# Altium schematic sheet Sheet2.SchDoc
size A; SheetNumber: 1; SheetTotal: 2
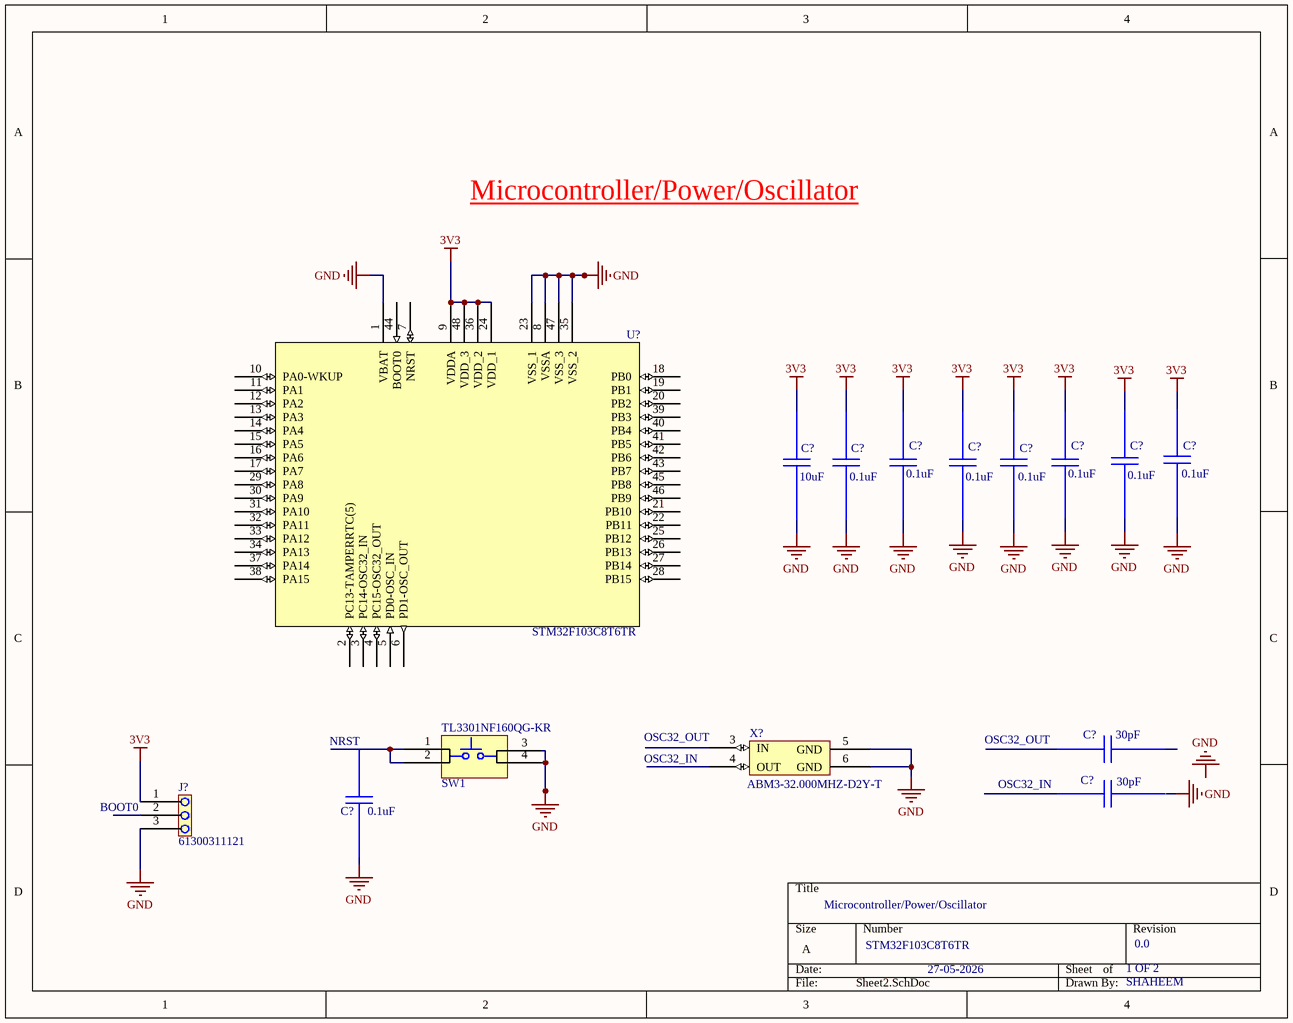
[diagram p0: Sheet2.SchDoc]

## Parts
(Parts that share a designator on the sheet are numbered #1, #2 ... from top to bottom, then left to right.)
C?#1  10uF
C?#2  0.1uF
C?#3  0.1uF
C?#4  0.1uF
C?#5  0.1uF
C?#6  0.1uF
C?#7  0.1uF
C?#8  0.1uF
C?#9  0.1uF
C?#10  30pF
C?#11  30pF
J?  61300311121
TL3301NF160QG-KR  SW1
U?  STM32F103C8T6TR
X?  ABM3-32.000MHZ-D2Y-T

## Nets
3V3: U?.9(VDDA) U?.24(VDD_1) U?.36(VDD_2) U?.48(VDD_3)
GND: U?.1(VBAT) U?.8(VSSA) U?.23(VSS_1) U?.35(VSS_2) U?.47(VSS_3) X?.5(GND) X?.6(GND)
NetTL3301NF160QG-KR_1: TL3301NF160QG-KR.1 TL3301NF160QG-KR.2

Not connected (* = marked no-connect by the designer): J? 1 2 3; TL3301NF160QG-KR 3 4; U? 2(PC13-TAMPERRTC(5)) 3(PC14-OSC32_IN) 4(PC15-OSC32_OUT) 5(PD0-OSC_IN) 6(PD1-OSC_OUT) 7(NRST) 10(PA0-WKUP) 11(PA1) 12(PA2) 13(PA3) 14(PA4) 15(PA5) 16(PA6) 17(PA7) 18(PB0) 19(PB1) 20(PB2) 21(PB10) 22(PB11) 25(PB12) 26(PB13) 27(PB14) 28(PB15) 29(PA8) 30(PA9) 31(PA10) 32(PA11) 33(PA12) 34(PA13) 37(PA14) 38(PA15) 39(PB3) 40(PB4) 41(PB5) 42(PB6) 43(PB7) 44(BOOT0) 45(PB8) 46(PB9); X? 3(IN) 4(OUT)

## Notes on the sheet
- Microcontroller/Power/Oscillator
- (near C?#9) NRST
- (near X?) OSC32_OUT
- OSC32_IN
- (near C?#10) OSC32_OUT
- (near J?) BOOT0
- (near C?#10) OSC32_IN
- STM32F103C8T6TR
- 27-05-2026
- 1 OF 2
- 0.0
- SHAHEEM
- Labels drawn without touching a wire or pin: GND

## Library data of the parts
C?#1-C?#11 = C0402C104K7PACTU: Multilayer Ceramic Capacitors MLCC - SMD/SMT V 0.1uF X5R 0402 10%; Manufacturer: Yageo Group; Value: 100nF; Voltage Rating (DC): 4V; Supplier: DigiKey; Supplier Part Number: 399-14871-2-ND; Manufacturer Part Number: C0402C104K7PACTU; RoHS: Compliant; Category: Ceramic Capacitors; Stock: 10000; Pricing: 10000=0.01597, 20000=0.01478, 30000=0.01419, 50000=0.01353, 70000=0.01314, 100000=0.01277 (USD); Case/Package: 0402; China RoHS: Compliant; Dielectric: X5R; Dielectric Material: Ceramic; Height: 500µm; Lead Free: Lead Free; Length: 1mm; Lifecycle Status: Production; Max Operating Temperature: 85°C; Min Operating Temperature: -55°C; Mounting Technology: Surface Mount; Number of Terminals: 2; REACH SVHC: Yes; Width: 500µm; ComponentLink1URL: https://datasheet.octopart.com:443/C0402C104K7PACTU-KEMET-datasheet-178499189.pdf?src-supplier=IHS; ComponentLink1Description: https://datasheet.octopart.com:443/C0402C104K7PACTU-KEMET-datasheet-178499189.pdf?src-supplier=IHS; ComponentLink2URL: https://datasheet.octopart.com:443/C0402C104K7PACTU-KEMET-datasheet-137357760.pdf?src-supplier=Ciiva; ComponentLink2Description: https://datasheet.octopart.com:443/C0402C104K7PACTU-KEMET-datasheet-137357760.pdf?src-supplier=Ciiva; ComponentLink3URL: https://datasheet.octopart.com/C0402C104K7PACTU-KEMET-datasheet-84169754.pdf; ComponentLink3Description: https://datasheet.octopart.com/C0402C104K7PACTU-KEMET-datasheet-84169754.pdf
J? = 61300311121: WR-PHD Straight Male, PCB Header, Through Hole, 1 Rows, 3 Contacts, 2.54mm Pitch; Manufacturer: Wurth Elektronik; Manufacturer Lifecycle Status: ACTIVE; Connector Type: Male Pin; Contact Resistance: 20mΩ; Current Rating: 3A; Insulation Resistance: 1GΩ; Number of Contacts: 3; Operating Supply Voltage: 250V; YEOL: 1 = Estimated lifetime > 10 years; Supplier: DigiKey; Supplier Part Number: 732-5316-ND; Manufacturer Part Number: 61300311121; RoHS: Compliant; Category: Headers and Wire Housings; Stock: 184690; Pricing: 1=0.13, 10=0.113, 25=0.094, 50=0.0798 (USD); Color: Black; Contact Material: Gold; Contact Mating Length: 5.9944mm; Contact Plating: Gold; Gender: Male; Height: 8.94mm; Lead Free: Lead Free; Lead Pitch: 2.54mm; Length: 7.62mm; Lifecycle Status: Production; Max Operating Temperature: 105°C; Min Operating Temperature: -40°C; Mounting Technology: Through Hole; Pins: 3; Number of Positions: 3; Number of Rows: 1; Orientation: Vertical; Packaging: Bulk; Pitch: 2.54mm; Termination: Solder; Voltage Rating: 250V; ComponentLink1URL: https://datasheet.octopart.com:443/61300311121-Wurth-Elektronik-datasheet-168684096.pdf?src-supplier=Wurth+Elektronik; ComponentLink1Description: https://datasheet.octopart.com:443/61300311121-Wurth-Elektronik-datasheet-168684096.pdf?src-supplier=Wurth+Elektronik; ComponentLink2URL: https://datasheet.octopart.com:443/61300311121-W%C3%BCrth-Elektronik-datasheet-44382959.pdf?src-supplier=Future+Electronics; ComponentLink2Description: https://datasheet.octopart.com:443/61300311121-W%C3%BCrth-Elektronik-datasheet-44382959.pdf?src-supplier=Future+Electronics; ComponentLink3URL: https://datasheet.octopart.com:443/61300311121-W%C3%BCrth-Elektronik-datasheet-149524047.pdf?src-supplier=Farnell; ComponentLink3Description: https://datasheet.octopart.com:443/61300311121-W%C3%BCrth-Elektronik-datasheet-149524047.pdf?src-supplier=Farnell; ComponentLink4URL: https://datasheet.octopart.com:443/61300311121-W%C3%BCrth-Elektronik-datasheet-21154836.pdf?src-supplier=element14+APAC; ComponentLink4Description: https://datasheet.octopart.com:443/61300311121-W%C3%BCrth-Elektronik-datasheet-21154836.pdf?src-supplier=element14+APAC; ComponentLink5URL: https://datasheet.octopart.com/613-003-111-21-W%C3%BCrth-Elektronik-datasheet-134615323.pdf; ComponentLink5Description: https://datasheet.octopart.com/613-003-111-21-W%C3%BCrth-Elektronik-datasheet-134615323.pdf
TL3301NF160QG-KR = TL3301NF160QG-KR: TL3301 Series SPST 1.6 N Round Button Gull Wing Surface Mount Tactile Switch; Manufacturer: E-Switch; Supplier: DigiKey; Supplier Part Number: 141-TL3301NF160QG-KRCT-ND; Manufacturer Part Number: TL3301NF160QG-KR; RoHS: Compliant; Category: Tactile Switches; Stock: 155244; Pricing: 1=0.25, 10=0.218, 25=0.2044, 100=0.1832, 250=0.16988, 500=0.16032 (USD); Export Control Classification Number (ECCN) Code: EAR99; Harmonized Tariff Schedule (HTS) Code: 8536.50.70.00; Introduction Date: 2022-07-21; Lifecycle Status: Production; REACH SVHC: Yes; ComponentLink1URL: https://datasheet.octopart.com:443/TL3301NF160QG-KR-E-Switch-datasheet-182203455.pdf?src-supplier=IHS; ComponentLink1Description: https://datasheet.octopart.com:443/TL3301NF160QG-KR-E-Switch-datasheet-182203455.pdf?src-supplier=IHS; ComponentLink2URL: https://datasheet.octopart.com:443/TL3301NF160QG-KR-E-Switch-datasheet-186526752.pdf?src-supplier=Future+Electronics; ComponentLink2Description: https://datasheet.octopart.com:443/TL3301NF160QG-KR-E-Switch-datasheet-186526752.pdf?src-supplier=Future+Electronics; ComponentLink3URL: https://datasheet.octopart.com:443/TL3301NF160QG-KR-E-Switch-datasheet-26831017.pdf?src-supplier=Future+Electronics; ComponentLink3Description: https://datasheet.octopart.com:443/TL3301NF160QG-KR-E-Switch-datasheet-26831017.pdf?src-supplier=Future+Electronics
U? = STM32F103C8T6TR: MCU 32-bit STM32F1 ARM Cortex M3 RISC 64KB Flash 2.5V/3.3V 48-Pin LQFP T/R; Manufacturer: STMicroelectronics; ADC Channels (Resolution): 10-Ch 12-Bit; Data Bus Width: 32b; EEPROM Memory Size: 0B; Frequency: 72MHz; Interface: CAN, IrDA, LIN, USB; Clock Frequency: 1.25MHz; Max Power Dissipation: 363mW; Max Supply Current: 50mA; Max Supply Voltage: 3.6V; Min Supply Voltage: 2V; Nominal Supply Current: 1.7µA; Number of A/D Converters: 2; Number of ADC Channels: 10; Number of I/Os: 37; Number of Timers/Counters: 4; Number of USART Channels: 3; Operating Supply Voltage: 3.3V; Oscillator Type: Internal; Peripherals: POR; RAM Size: 20kB; Watchdog Timer: Yes; Supplier: DigiKey; Supplier Part Number: 497-17666-1-ND; Manufacturer Part Number: STM32F103C8T6TR; RoHS: Compliant; Category: Microcontrollers; Stock: 4099; Pricing: 1=6.15, 10=4.713, 25=4.3536, 100=3.9587, 250=3.77388 (USD); Case/Package: LFQFP; China RoHS: Compliant; Contact Plating: Gold; Core Architecture: ARM; Flash Memory Size: 64kB; Height - Seated (Max): 1.6mm; Lead Free: Lead Free; Length: 7mm; Lifecycle Status: Production; Max Operating Temperature: 85°C; Memory Size: 64kB; Memory Format: FLASH; Min Operating Temperature: -40°C; Number of Channels: 10; Number of I2C Channels: 2; Pins: 48; Number of Programmable I/O: 37; Number of SPI Channels: 2; Number of Terminals: 48; Packaging: Tape and Reel; Radiation Hardening: No; REACH SVHC: Yes; Schedule B: 8542310000, 8542310000|8542310000|8542310000|8542310000|8542310000; Temperature Grade: Industrial; Terminal Pitch: 500µm; Width: 7mm; ComponentLink1URL: https://datasheet.octopart.com:443/STM32F103C8T6TR-STMicroelectronics-datasheet-177520228.pdf?src-supplier=IHS; ComponentLink1Description: https://datasheet.octopart.com:443/STM32F103C8T6TR-STMicroelectronics-datasheet-177520228.pdf?src-supplier=IHS; ComponentLink2URL: https://datasheet.octopart.com:443/STM32F103C8T6TR-STMicroelectronics-datasheet-48026265.pdf?src-supplier=STMicroelectronics+SCT; ComponentLink2Description: https://datasheet.octopart.com:443/STM32F103C8T6TR-STMicroelectronics-datasheet-48026265.pdf?src-supplier=STMicroelectronics+SCT; ComponentLink3URL: https://datasheet.octopart.com:443/STM32F103C8T6TR-STMicroelectronics-datasheet-14363502.pdf?src-supplier=Upverter; ComponentLink3Description: https://datasheet.octopart.com:443/STM32F103C8T6TR-STMicroelectronics-datasheet-14363502.pdf?src-supplier=Upverter; ComponentLink4URL: https://datasheet.octopart.com:443/STM32F103C8T6TR-STMicroelectronics-datasheet-10330614.pdf?src-supplier=STMicroelectronics; ComponentLink4Description: https://datasheet.octopart.com:443/STM32F103C8T6TR-STMicroelectronics-datasheet-10330614.pdf?src-supplier=STMicroelectronics; ComponentLink5URL: https://datasheet.octopart.com:443/STM32F103C8T6TR-STMicroelectronics-datasheet-500013.pdf?src-supplier=STMicroelectronics; ComponentLink5Description: https://datasheet.octopart.com:443/STM32F103C8T6TR-STMicroelectronics-datasheet-500013.pdf?src-supplier=STMicroelectronics; ComponentLink6URL: https://datasheet.octopart.com:443/STM32F103C8T6TR-STMicroelectronics-datasheet-14106724.pdf?src-supplier=iiiC; ComponentLink6Description: https://datasheet.octopart.com:443/STM32F103C8T6TR-STMicroelectronics-datasheet-14106724.pdf?src-supplier=iiiC; ComponentLink7URL: https://datasheet.octopart.com:443/STM32F103C8T6TR-STMicroelectronics-datasheet-17594274.pdf?src-supplier=TME; ComponentLink7Description: https://datasheet.octopart.com:443/STM32F103C8T6TR-STMicroelectronics-datasheet-17594274.pdf?src-supplier=TME; ComponentLink8URL: https://datasheet.octopart.com:443/STM32F103C8T6TR-STMicroelectronics-datasheet-6396519.pdf?src-supplier=SHENGYU+ELECTRONICS; ComponentLink8Description: https://datasheet.octopart.com:443/STM32F103C8T6TR-STMicroelectronics-datasheet-6396519.pdf?src-supplier=SHENGYU+ELECTRONICS
X? = ABM3: Crystal 32MHz ±20ppm (Tol) ±30ppm (Stability) 18pF FUND 25Ohm 2-Pin Mini-CSMD T/R; Manufacturer: Abracon; ESR (Equivalent Series Resistance): 25Ω; Frequency Tolerance: 0.002%; Supplier: DigiKey; Supplier Part Number: 535-10648-2-ND; Manufacturer Part Number: ABM3-32.000MHZ-D2Y-T; RoHS: Compliant; Category: Crystals; Stock: 24871; Pricing: 1000=0.36759, 2000=0.35239, 3000=0.34379, 5000=0.33326, 7000=0.3265, 10000=0.31949 (USD); Case/Package: CSMD; China RoHS: Non-Compliant; Composition: Ceramic; Country of Origin: South Korea; Depth: 3.2mm; Frequency: 32MHz; Frequency Stability: 30ppm; Height: 1.3mm; Harmonized Tariff Schedule (HTS) Code: 8541.60.00.60; Introduction Date: 2013-09-25; Lead Free: Lead Free; Length: 5mm; Lifecycle Status: Production; Load Capacitance: 18pF; Max Operating Temperature: 85°C; Min Operating Temperature: -40°C; Mounting Technology: Surface Mount; Pins: 2; REACH SVHC: Yes; Schedule B: 8541600060; ESR: 25Ω; Termination: SMD/SMT; Tolerance: 0.002%; Width: 3.2mm; ComponentLink1URL: https://datasheet.octopart.com:443/ABM3-32.000MHZ-D2Y-T-Abracon-datasheet-182205007.pdf?src-supplier=JRH+Electronics; ComponentLink1Description: https://datasheet.octopart.com:443/ABM3-32.000MHZ-D2Y-T-Abracon-datasheet-182205007.pdf?src-supplier=JRH+Electronics; ComponentLink2URL: https://datasheet.octopart.com:443/ABM3-32.000MHZ-D2Y-T-Abracon-datasheet-32780515.pdf?src-supplier=IHS; ComponentLink2Description: https://datasheet.octopart.com:443/ABM3-32.000MHZ-D2Y-T-Abracon-datasheet-32780515.pdf?src-supplier=IHS; ComponentLink3URL: https://datasheet.octopart.com:443/ABM3-32.000MHZ-D2Y-T-Abracon-datasheet-13417521.pdf?src-supplier=Sager+Electronics; ComponentLink3Description: https://datasheet.octopart.com:443/ABM3-32.000MHZ-D2Y-T-Abracon-datasheet-13417521.pdf?src-supplier=Sager+Electronics; ComponentLink4URL: https://datasheet.octopart.com:443/ABM3-32.000MHZ-D2Y-T-Abracon-datasheet-8862594.pdf?src-supplier=Sager+Electronics; ComponentLink4Description: https://datasheet.octopart.com:443/ABM3-32.000MHZ-D2Y-T-Abracon-datasheet-8862594.pdf?src-supplier=Sager+Electronics; ComponentLink5URL: https://datasheet.octopart.com:443/ABM3-32.000MHZ-D2Y-T-Abracon-datasheet-8853172.pdf?src-supplier=Sager+Electronics; ComponentLink5Description: https://datasheet.octopart.com:443/ABM3-32.000MHZ-D2Y-T-Abracon-datasheet-8853172.pdf?src-supplier=Sager+Electronics; ComponentLink6URL: https://datasheet.octopart.com:443/ABM3-32.000MHZ-D2Y-T-Abracon-datasheet-8835795.pdf?src-supplier=Sager+Electronics; ComponentLink6Description: https://datasheet.octopart.com:443/ABM3-32.000MHZ-D2Y-T-Abracon-datasheet-8835795.pdf?src-supplier=Sager+Electronics; ComponentLink7URL: https://datasheet.octopart.com:443/ABM3-32.000MHZ-D2Y-T-Abracon-datasheet-8815637.pdf?src-supplier=Sager+Electronics; ComponentLink7Description: https://datasheet.octopart.com:443/ABM3-32.000MHZ-D2Y-T-Abracon-datasheet-8815637.pdf?src-supplier=Sager+Electronics; ComponentLink8URL: https://datasheet.octopart.com:443/ABM3-32.000MHZ-D2Y-T-Abracon-datasheet-8808528.pdf?src-supplier=Sager+Electronics; ComponentLink8Description: https://datasheet.octopart.com:443/ABM3-32.000MHZ-D2Y-T-Abracon-datasheet-8808528.pdf?src-supplier=Sager+Electronics; ComponentLink9URL: https://datasheet.octopart.com:443/ABM3-32.000MHZ-D2Y-T-Abracon-datasheet-8488864.pdf?src-supplier=Sager+Electronics; ComponentLink9Description: https://datasheet.octopart.com:443/ABM3-32.000MHZ-D2Y-T-Abracon-datasheet-8488864.pdf?src-supplier=Sager+Electronics; ComponentLink10URL: https://datasheet.octopart.com:443/ABM3-32.000MHZ-D2Y-T-Abracon-datasheet-8324950.pdf?src-supplier=Sager+Electronics; ComponentLink10Description: https://datasheet.octopart.com:443/ABM3-32.000MHZ-D2Y-T-Abracon-datasheet-8324950.pdf?src-supplier=Sager+Electronics; ComponentLink11URL: https://datasheet.octopart.com:443/ABM3-32.000MHZ-D2Y-T-Abracon-datasheet-577709.pdf?src-supplier=Sager+Electronics; ComponentLink11Description: https://datasheet.octopart.com:443/ABM3-32.000MHZ-D2Y-T-Abracon-datasheet-577709.pdf?src-supplier=Sager+Electronics; ComponentLink12URL: https://datasheet.octopart.com:443/ABM3-32.000MHZ-D2Y-T-Abracon-datasheet-154724144.pdf?src-supplier=Sager+Electronics; ComponentLink12Description: https://datasheet.octopart.com:443/ABM3-32.000MHZ-D2Y-T-Abracon-datasheet-154724144.pdf?src-supplier=Sager+Electronics; ComponentLink13URL: https://sigma.octopart.com:443/138895675/technical_drawing/Abracon-ABM3-32.000MHZ-D2Y-T.pdf?src-supplier=Abracon+SCT; ComponentLink13Description: https://sigma.octopart.com:443/138895675/technical_drawing/Abracon-ABM3-32.000MHZ-D2Y-T.pdf?src-supplier=Abracon+SCT; ComponentLink14URL: http://sigma.octopart.com:80/conflict_mineral_statement/Abracon-company-27.pdf?src-supplier=Compliance+Statements; ComponentLink14Description: http://sigma.octopart.com:80/conflict_mineral_statement/Abracon-company-27.pdf?src-supplier=Compliance+Statements